# Altium schematic sheet 12 CAN, ADC, DAC.SchDoc
size B; DocumentNumber: 12; SheetNumber: 12; SheetTotal: 17
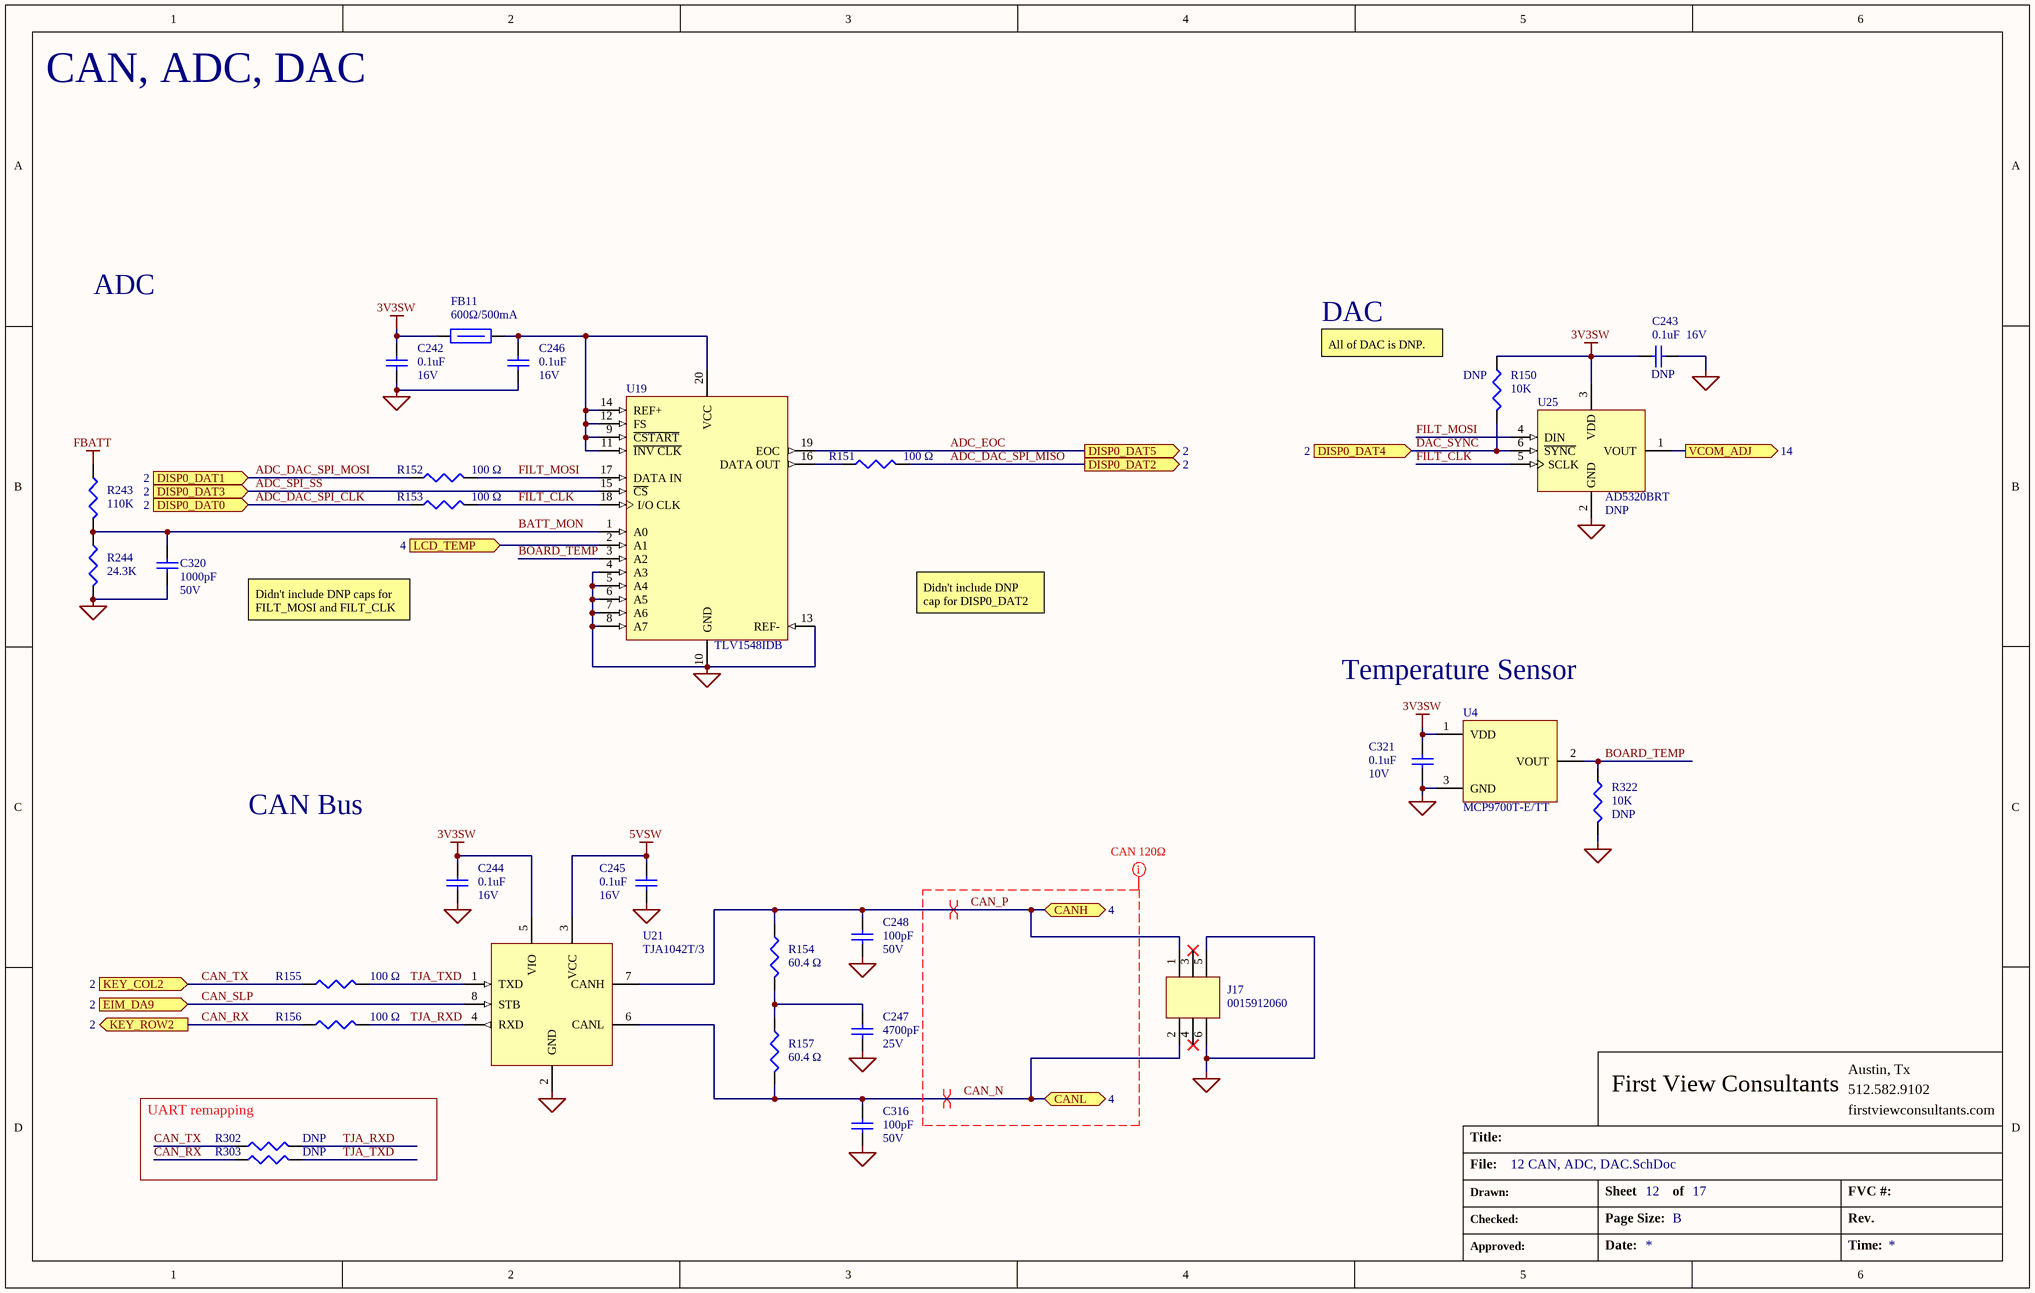
[diagram p0: 12 CAN, ADC, DAC.SchDoc]

## Parts
C242  value 0.1uF  Voltage: 16V  [CAP_0402]  (hidden comment: Cap 0.1uF 16V 0402)
C243  value 0.1uF  Voltage: 16V  [CAP_0402]  (hidden comment: Cap 0.1uF 16V 0402)
C244  value 0.1uF  Voltage: 16V  [CAP_0402]  (hidden comment: Cap 0.1uF 16V 0402)
C245  value 0.1uF  Voltage: 16V  [CAP_0402]  (hidden comment: Cap 0.1uF 16V 0402)
C246  value 0.1uF  Voltage: 16V  [CAP_0402]  (hidden comment: Cap 0.1uF 16V 0402)
C247  value 4700pF  Voltage: 25V  [CAP_0603]  (hidden comment: Cap 4700pF 25V 0603)
C248  value 100pF  Voltage: 50V  [CAP_0402]  (hidden comment: Cap 100pF 50V 0402)
C316  value 100pF  Voltage: 50V  [CAP_0402]  (hidden comment: Cap 100pF 50V 0402)
C320  value 1000pF  Voltage: 50V  [CAP_0402]  (hidden comment: Cap 1000pF 50V 0402)
C321  value 0.1uF  Voltage: 10V  [CAP_0402]  (hidden comment: Cap 0.1uF 10V 0402)
FB11  value 600Ω/500mA  [IND_0603]  (hidden comment: BLM18EG601SN1D)
J17  0015912060  [CON_0015912060]
R150  value 10K  [RES_0402]  (hidden comment: Res 10K 0.063W)
R151  value 100 Ω  [RES_0402]  (hidden comment: Res 100R 0.063W)
R152  value 100 Ω  [RES_0402]  (hidden comment: Res 100R 0.063W)
R153  value 100 Ω  [RES_0402]  (hidden comment: Res 100R 0.063W)
R154  value 60.4 Ω  [RES_0402]  (hidden comment: Res 60.4R 0.063W)
R155  value 100 Ω  [RES_0402]  (hidden comment: Res 100R 0.063W)
R156  value 100 Ω  [RES_0402]  (hidden comment: Res 100R 0.063W)
R157  value 60.4 Ω  [RES_0402]  (hidden comment: Res 60.4R 0.063W)
R243  value 110K  [RES_0402]  (hidden comment: Res 110K 0.063W)
R244  value 24.3K  [RES_0402]  (hidden comment: Res 24.3K 0.063W)
R302  Res 100R 0.063W  [RES_0402]  (value not drawn)
R303  Res 100R 0.063W  [RES_0402]  (value not drawn)
R322  value 10K  [RES_0402]  (hidden comment: Res 10K 0.063W)
U4  MCP9700T-E/TT  [SOT-23-3_MCP9700T-E/TT]
U19  TLV1548IDB  [SSOP-20_TLV1548IDB]
U21  TJA1042T/3  [SOIC-8_TJA1042T/3]
U25  AD5320BRT  [SOT-23-6_AD5320BRT]

## Blocks framed on the sheet
UART remapping: R302 R303

## Ports
CANH (bidir, see 4), CANL (bidir, see 4), DISP0_DAT0 (in, see 2), DISP0_DAT1 (in, see 2), DISP0_DAT2 (out, see 2), DISP0_DAT3 (in, see 2), DISP0_DAT4 (in, see 2), DISP0_DAT5 (out, see 2), EIM_DA9 (in, see 2), KEY_COL2 (in, see 2), KEY_ROW2 (out, see 2), LCD_TEMP (in, see 4), VCOM_ADJ (out, see 14)

## Nets
3V3SW: C242.2 C243.1 C244.1 C321.1 FB11.1 R150.1 U4.1(VDD) U21.5(VIO) U25.3(VDD)
5VSW: C245.1 U21.3(VCC)
FBATT: R243.1
GND: C242.1 C243.2 C244.2 C245.2 C246.1 C247.2 C248.2 C316.2 C320.2 C321.2 J17.5 J17.6 R244.2 R322.2 U4.3(GND) U19.4(A3) U19.5(A4) U19.6(A5) U19.7(A6) U19.8(A7) U19.10(GND) U19.13(REF-) U21.2(GND) U25.2(GND)
ADC_DAC_SPI_CLK: R153.1 ; port DISP0_DAT0
ADC_DAC_SPI_MISO: R151.2 ; port DISP0_DAT2
ADC_DAC_SPI_MOSI: R152.1 ; port DISP0_DAT1
ADC_EOC: U19.19(EOC) ; port DISP0_DAT5
ADC_SPI_SS: U19.15(~{CS}) ; port DISP0_DAT3
BATT_MON: C320.1 R243.2 R244.1 U19.1(A0)
BOARD_TEMP: R322.1 U4.2(VOUT) U19.3(A2)
CAN_N: C316.1 J17.2 R157.2 U21.6(CANL) ; port CANL
CAN_P: C248.1 J17.1 R154.1 U21.7(CANH) ; port CANH
CAN_RX: R156.1 R303.1 ; port KEY_ROW2
CAN_SLP: U21.8(STB) ; port EIM_DA9
CAN_TX: R155.1 R302.1 ; port KEY_COL2
DAC_SYNC: R150.2 U25.6(~{SYNC}) ; port DISP0_DAT4
FILT_CLK: R153.2 U19.18(I/O_CLK) U25.5(SCLK)
FILT_MOSI: R152.2 U19.17(DATA_IN) U25.4(DIN)
LCD_TEMP: U19.2(A1) ; port LCD_TEMP
TJA_RXD: R156.2 R302.2 U21.4(RXD)
TJA_TXD: R155.2 R303.2 U21.1(TXD)
VCOM_ADJ: U25.1(VOUT) ; port VCOM_ADJ
NetC246_2: C246.2 FB11.2 U19.9(~{CSTART}) U19.11(~{INV_CLK}) U19.12(FS) U19.14(REF+) U19.20(VCC)
NetC247_1: C247.1 R154.2 R157.1
NetR151_1: R151.1 U19.16(DATA_OUT)

Not connected (* = marked no-connect by the designer): J17 3* 4*

## Layout directives
differential pair: CAN_N, CAN_P
net class CAN 120ohm: CAN_N, CAN_P

## Notes on the sheet
- CAN, ADC, DAC
- ADC
- DAC
- All of DAC is DNP.
- Didn't include DNP caps for FILT_MOSI and FILT_CLK
- Didn't include DNP cap for DISP0_DAT2
- Temperature Sensor
- CAN Bus
- First View Consultants
- Austin, Tx
- 512.582.9102
- Title:
- File:
- firstviewconsultants.com
- Drawn:
- Checked:
- Sheet
- Page Size:
- of
- B
- FVC #:
- Rev.
- Approved:
- Date:
- Time:

## Library data of the parts
C242-C246 = Cap 0.1uF 16V 0402: Cap, Cer, 0.1uF, 16V, 10%, X7R, 0402; Manufacturer #: GRM155R71C104KA88D; Manufacturer: Murata Electronics North America; Have Footprint: yes; Package: 0402; Tolerance: ±10%
  C243: DNP: DNP
C247 = Cap 4700pF 25V 0603: Cap, Cer, 4700pF, 25V, 5%, C0G, 0603; Manufacturer: TDK Corporation; Manufacturer #: C1608C0G1E472J080AA; Have Footprint: yes; Tolerance: 5%; PACKAGE: 0603
C248 C316 = Cap 100pF 50V 0402: Cap, Cer, 100pF, 50V, 5%, C0G/NP0, 0402; Manufacturer #: CC0402JRNPO9BN101; Manufacturer: Yageo; Have Footprint: yes; PACKAGE: 0402; Tolerance: 5%
C320 = Cap 1000pF 50V 0402: Cap, Cer, 1000pF, 50V, 20%, X7R, 0402; Manufacturer: Murata Electronics North America; Manufacturer #: GRM155R71H102KA01D; Have Footprint: yes; Tolerance: 20%; PACKAGE: 0402
C321 = Cap 0.1uF 10V 0402: Cap, Cer, 0.1uF, 10V, 10%, X5R, 0402; Manufacturer: Murata Electronics North America; Manufacturer #: GRM155R61A104KA01J; Have Footprint: yes; Tolerance: ±10%; PACKAGE: 0402
FB11 = BLM18EG601SN1D: Ind, Ferrite Bead, 600R, 350mOhm, 0.5A, 0603; Manufacturer: Murata Electronics North America; Have Footprint: yes; Manufacturer #: BLM18EG601SN1D; Package: 0603
J17 = 0015912060: Conn, Header, 6 pos, 0.1" pitch, SMD; Manufacturer: Molex Inc; Have Footprint: yes; Manufacturer #: 0015912060; Cost: 0.43
R150 R322 = Res 10K 0.063W: Res, 10K, 1/16W, 1%, 0402; Manufacturer #: RC0402FR-0710KL; Manufacturer: Yageo; Have Footprint: yes; Package: 0402; DNP: DNP
R151-R153 R155 R156 = Res 100R 0.063W: Res, 100R, 0.063W, 1%, 0402; Manufacturer #: TRR01MZPF1000; Manufacturer: Murata Electronics North America; Have Footprint: yes; Package: 0402
R154 R157 = Res 60.4R 0.063W: Res, 60.4, 1/16W, 1%, 0402; Manufacturer #: RMCF0402FT60R4; Manufacturer: Stackpole Electronics Inc; Have Footprint: yes; Package: 0402
R243 = Res 110K 0.063W: Res, 110K, 0.063W, 5%, 0402; Manufacturer #: MCR01MRTJ114; Manufacturer: Rohm Semiconductor; Have Footprint: yes; Package: 0402; Tolerance: 5%
R244 = Res 24.3K 0.063W: Res, 24.3K, 0.063W, 5%, 0402; Manufacturer #: RMCF0402FT24K3; Manufacturer: Stackpole Electronics Inc; Tolerance: 1%; Have Footprint: yes; Package: 0402
R302 R303 = Res 100R 0.063W: Res, 100R, 0.063W, 1%, 0402; Manufacturer #: TRR01MZPF1000; Manufacturer: Murata Electronics North America; Value: 100 Ω; Have Footprint: yes; Package: 0402; DNP: DNP
U4 = MCP9700T-E/TT: IC, Temp Sensor, 0-70°C, 2.3-5.5V, VSOT-23-3; Manufacturer: Microchip Technology; Have Footprint: yes; Manufacturer #: MCP9700T-E/TT; Package: SOT-23-3; Operating Temperature: -40°C ~ 125°C
U19 = TLV1548IDB: IC, ADC, 8-ch, 10-Bit, SER, 85Ksps, SSOP-20; Manufacturer: Texas Instruments; Package: SSOP-20; RoHS: yes; Manufacturer #: TLV1548IDB
U21 = TJA1042T/3: IC, CAN, 3-5V, SOIC-8; Manufacturer: NXP Semiconductor; Have Footprint: yes; Package: SOIC-8; Operating Temperature: -40°C ~ 150°C; RoHS: YES; Manufacturer #: TJA1042T/3
U25 = AD5320BRT: IC, DAC, 12-Bit, 2.7-5.5V, 140uA, SOT-23; Manufacturer: Analog Devices; Have Footprint: yes; DNP: DNP; Manufacturer #: AD5320BRT